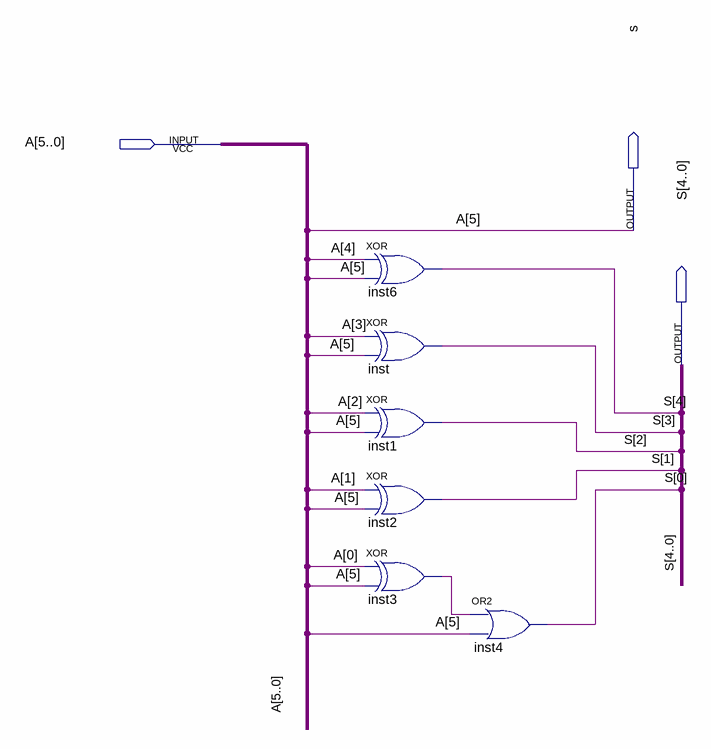
[diagram p0: schematic sheet]
// Quartus schematic complemento2_saida - Copy.bdf as structural Verilog: 6 symbols, 3 pins
module \complemento2_saida_-_Copy  (
  input  [5:0] A,
  output S_1bit,
  output [4:0] S
);

  wire inst3_out;

  xor inst6 (S[4], A[4], A[5]);
  xor inst (S[3], A[3], A[5]);
  xor inst1 (S[2], A[2], A[5]);
  xor inst2 (S[1], A[1], A[5]);
  xor inst3 (inst3_out, A[0], A[5]);
  or inst4 (S[0], inst3_out, A[5]);

  assign S_1bit = A[5];
endmodule
